# EAGLE design SparkFun_SOIC28-DIP-Adapter-v10 (EAGLE 7.2.0)
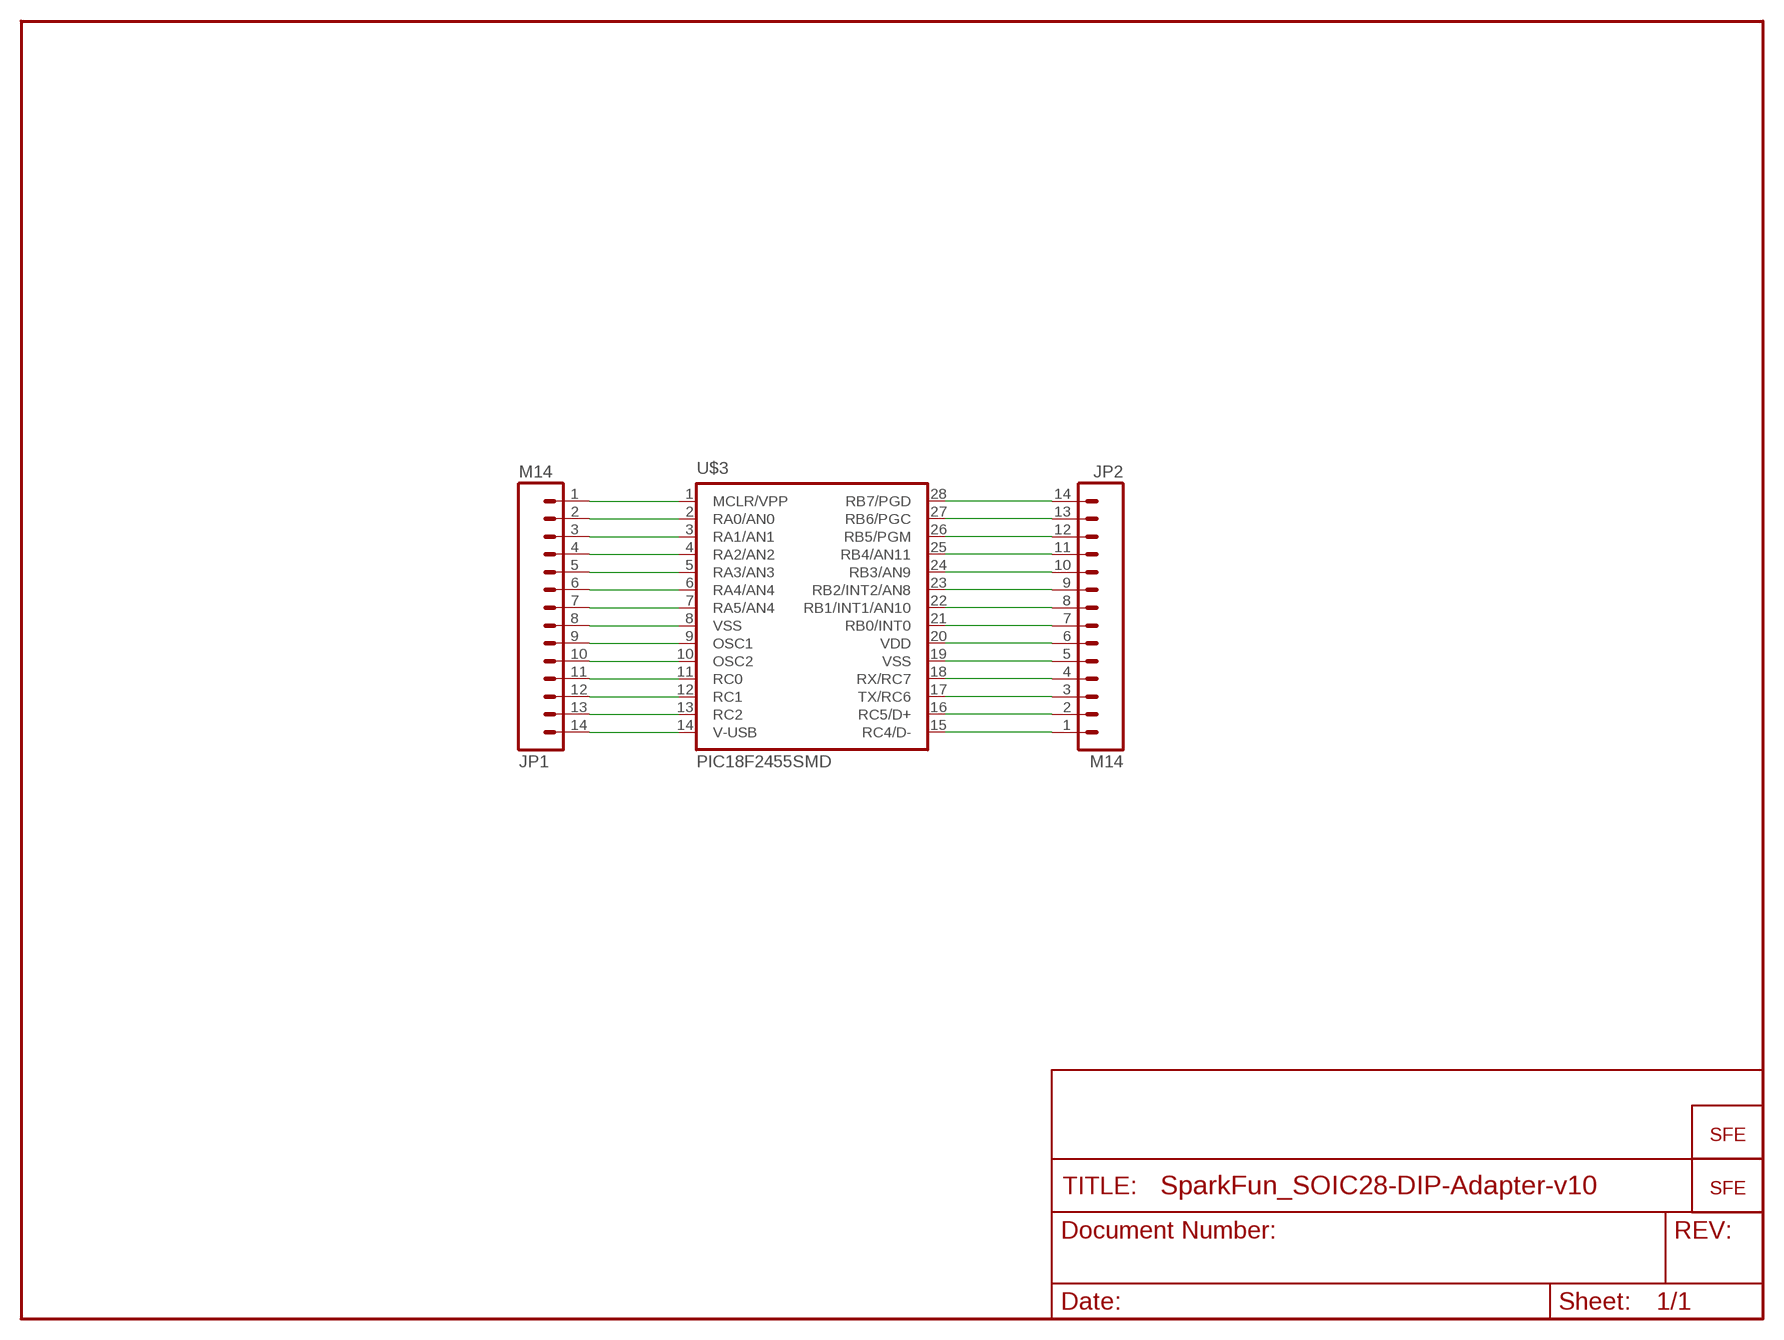
[diagram p0: schematic, sheet 1]

## Parts
JP1  M14  [1X14]
JP2  M14  [1X14]
U$1  LOGO-SFESK  [SFE-LOGO-FLAME]
U$2  LOGO-SFENEW  [SFE-NEW-WEBLOGO]
U$3  PIC18F2455SMD  [SO-28W]

## Nets
N$1: JP1.1 U$3.1(MCLR/VPP)
N$2: JP1.2 U$3.2(RA0/AN0)
N$3: JP1.3 U$3.3(RA1/AN1)
N$4: JP1.4 U$3.4(RA2/AN2)
N$5: JP1.5 U$3.5(RA3/AN3)
N$6: JP1.6 U$3.6(RA4/AN4)
N$7: JP1.7 U$3.7(RA5/AN4)
N$8: JP1.8 U$3.8(VSS)
N$9: JP1.9 U$3.9(OSC1)
N$10: JP1.10 U$3.10(OSC2)
N$11: JP1.11 U$3.11(RC0)
N$12: JP1.12 U$3.12(RC1)
N$13: JP1.13 U$3.13(RC2)
N$14: JP1.14 U$3.14(V-USB)
N$15: JP2.1 U$3.15(RC4/D-)
N$16: JP2.2 U$3.16(RC5/D+)
N$17: JP2.3 U$3.17(TX/RC6)
N$18: JP2.4 U$3.18(RX/RC7)
N$19: JP2.5 U$3.19(VSS)
N$20: JP2.6 U$3.20(VDD)
N$21: JP2.7 U$3.21(RB0/INT0)
N$22: JP2.8 U$3.22(RB1/INT1/AN10)
N$23: JP2.9 U$3.23(RB2/INT2/AN8)
N$24: JP2.10 U$3.24(RB3/AN9)
N$25: JP2.11 U$3.25(RB4/AN11)
N$26: JP2.12 U$3.26(RB5/PGM)
N$27: JP2.13 U$3.27(RB6/PGC)
N$28: JP2.14 U$3.28(RB7/PGD)

## Library data of the parts
JP1 JP2 = SparkFun:M14: Header 14 Standard 14-pin 0.1" header. Use with straight break away headers (SKU : PRT-00116), right angle break away headers (PRT-00553), swiss pins (PRT-00743), machine pins (PRT-00117), and female headers (PRT-00115).
U$1 U$2 = SparkFun:LOGO-SFE: Spark Fun Electronics PCB Logo This is the standard Spark Fun Electronics PCB logo.
U$3 = SparkFun:PIC18F2455

## Board
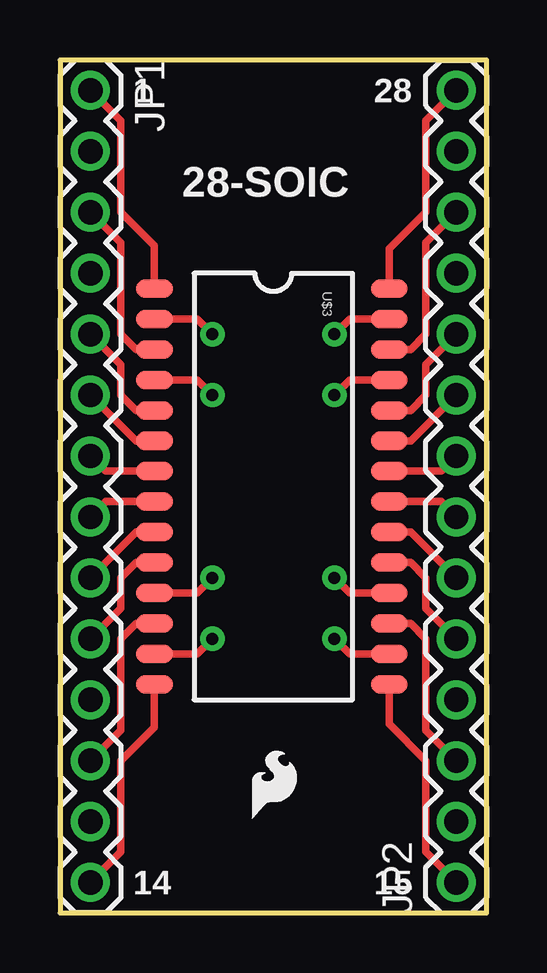
[diagram p1: board, top side]
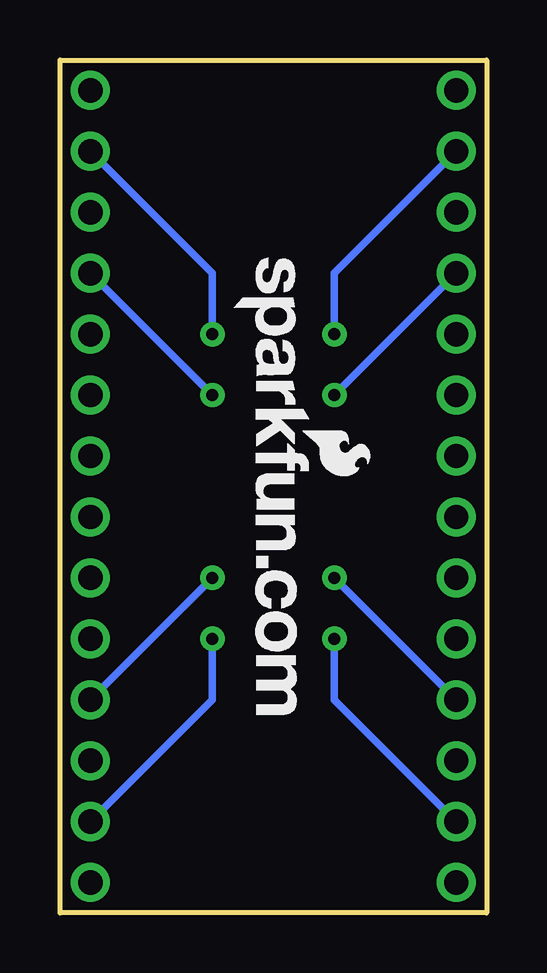
[diagram p2: board, bottom side, seen from below]

Size 17.78 x 35.56 mm. Coordinates in mm from the lower left corner, seen from the top.
Outline: 0,0 17.78,0 17.78,35.56 0,35.56 0,0
Copper layers (1*16): Top 0.035mm / dielectric 1.5mm / Bottom 0.035mm
Design rules "SparkFun": minimum track width 8mil, minimum drill 20mil, track to track 8mil, track to pad 8mil, pad to pad 8mil, via to via 8mil, smd to smd 8mil, copper to edge 10mil, drill to drill 8mil, minimum pad ring 12mil, minimum via ring 10mil, stop-mask expansion 4mil, vias tented up to drill 25mil, thermal gap 10mil

### Footprints (pad centres in the part's own frame; a part is rotated, then mirrored left to right if it is on the bottom)
1X14 = drill 1.016: 1 0,0; 2 2.54,0; 3 5.08,0; 4 7.62,0; 5 10.16,0; 6 12.7,0; 7 15.24,0; 8 17.78,0; 9 20.32,0; 10 22.86,0; 11 25.4,0; 12 27.94,0; 13 30.48,0; 14 33.02,0
SO-28W = smd 0.762 x 1.524: 1 -8.255,-4.953; 2 -6.985,-4.953; 3 -5.715,-4.953; 4 -4.445,-4.953; 5 -3.175,-4.953; 6 -1.905,-4.953; 7 -0.635,-4.953; 8 0.635,-4.953; 9 1.905,-4.953; 10 3.175,-4.953; 11 4.445,-4.953; 12 5.715,-4.953; 13 6.985,-4.953; 14 8.255,-4.953; 15 8.255,4.826; 16 6.985,4.826; 17 5.715,4.826; 18 4.445,4.826; 19 3.175,4.826; 20 1.905,4.826; 21 0.635,4.826; 22 -0.635,4.826; 23 -1.905,4.826; 24 -3.175,4.826; 25 -4.445,4.826; 26 -5.715,4.826; 27 -6.985,4.826; 28 -8.255,4.826

### Placement (x,y rotation side)
JP1  1.27,34.29 270 top
JP2  16.51,1.27 90 top
U$1  8,3.94 0 top
U$2  10.54,27.3 270 bottom
U$3  8.89,17.78 270 top

### Tracks (layer width: path | path; a pad name or v marks a point on that pad's centre or on a via)
N$1
  Top 0.305: U$3.1 3.94,27.81 2.54,29.21 2.54,33.02 JP1.1
N$2  (via drill 0.51)
  Top 0.305: U$3.2 5.71,24.77 v6.35,24.13
  Bottom 0.305: v6.35,24.13 6.35,26.67 JP1.2
N$3
  Top 0.305: U$3.3 3.17,23.5 2.54,24.13 2.54,27.94 JP1.3
N$4  (via drill 0.51)
  Top 0.305: U$3.4 5.71,22.23 v6.35,21.59
  Bottom 0.305: v6.35,21.59 JP1.4
N$5
  Top 0.305: U$3.5 3.17,20.95 2.54,21.59 2.54,22.86 JP1.5
N$6
  Top 0.305: U$3.6 3.17,19.68 JP1.6
N$7
  Top 0.305: U$3.7 1.91,18.41 JP1.7
N$8
  Top 0.305: U$3.8 1.91,17.14 JP1.8
N$9
  Top 0.305: U$3.9 3.17,15.88 JP1.9
N$10
  Top 0.305: U$3.10 3.17,14.61 2.54,13.97 2.54,12.7 JP1.10
N$11  (via drill 0.51)
  Top 0.305: U$3.11 5.71,13.34 v6.35,13.97
  Bottom 0.305: JP1.11 v6.35,13.97
N$12
  Top 0.305: U$3.12 3.17,12.06 2.54,11.43 2.54,7.62 JP1.12
N$13  (via drill 0.51)
  Top 0.305: U$3.13 5.71,10.79 v6.35,11.43
  Bottom 0.305: v6.35,11.43 6.35,8.89 JP1.13
N$14
  Top 0.305: U$3.14 3.94,7.75 2.54,6.35 2.54,2.54 JP1.14
N$15
  Top 0.305: U$3.15 13.72,7.87 15.24,6.35 15.24,2.54 JP2.1
N$16  (via drill 0.51)
  Top 0.305: U$3.16 12.06,10.79 v11.43,11.43
  Bottom 0.305: v11.43,11.43 11.43,8.89 JP2.2
N$17
  Top 0.305: U$3.17 14.61,12.06 15.24,11.43 15.24,7.62 JP2.3
N$18  (via drill 0.51)
  Top 0.305: U$3.18 12.06,13.34 v11.43,13.97
  Bottom 0.305: JP2.4 v11.43,13.97
N$19
  Top 0.305: U$3.19 14.61,14.61 15.24,13.97 15.24,12.7 JP2.5
N$20
  Top 0.305: U$3.20 14.61,15.88 JP2.6
N$21
  Top 0.305: U$3.21 15.88,17.14 JP2.7
N$22
  Top 0.305: U$3.22 15.88,18.41 JP2.8
N$23
  Top 0.305: U$3.23 14.61,19.68 JP2.9
N$24
  Top 0.305: U$3.24 14.61,20.95 15.24,21.59 15.24,22.86 JP2.10
N$25  (via drill 0.51)
  Top 0.305: U$3.25 12.06,22.23 v11.43,21.59
  Bottom 0.305: v11.43,21.59 JP2.11
N$26
  Top 0.305: U$3.26 14.61,23.5 15.24,24.13 15.24,27.94 JP2.12
N$27  (via drill 0.51)
  Top 0.305: U$3.27 12.06,24.77 v11.43,24.13
  Bottom 0.305: v11.43,24.13 11.43,26.67 JP2.13
N$28
  Top 0.305: U$3.28 13.72,27.69 15.24,29.21 15.24,33.02 JP2.14

### Text on the board
tPlace: 1 | 28 | 28-SOIC | 14 | 15